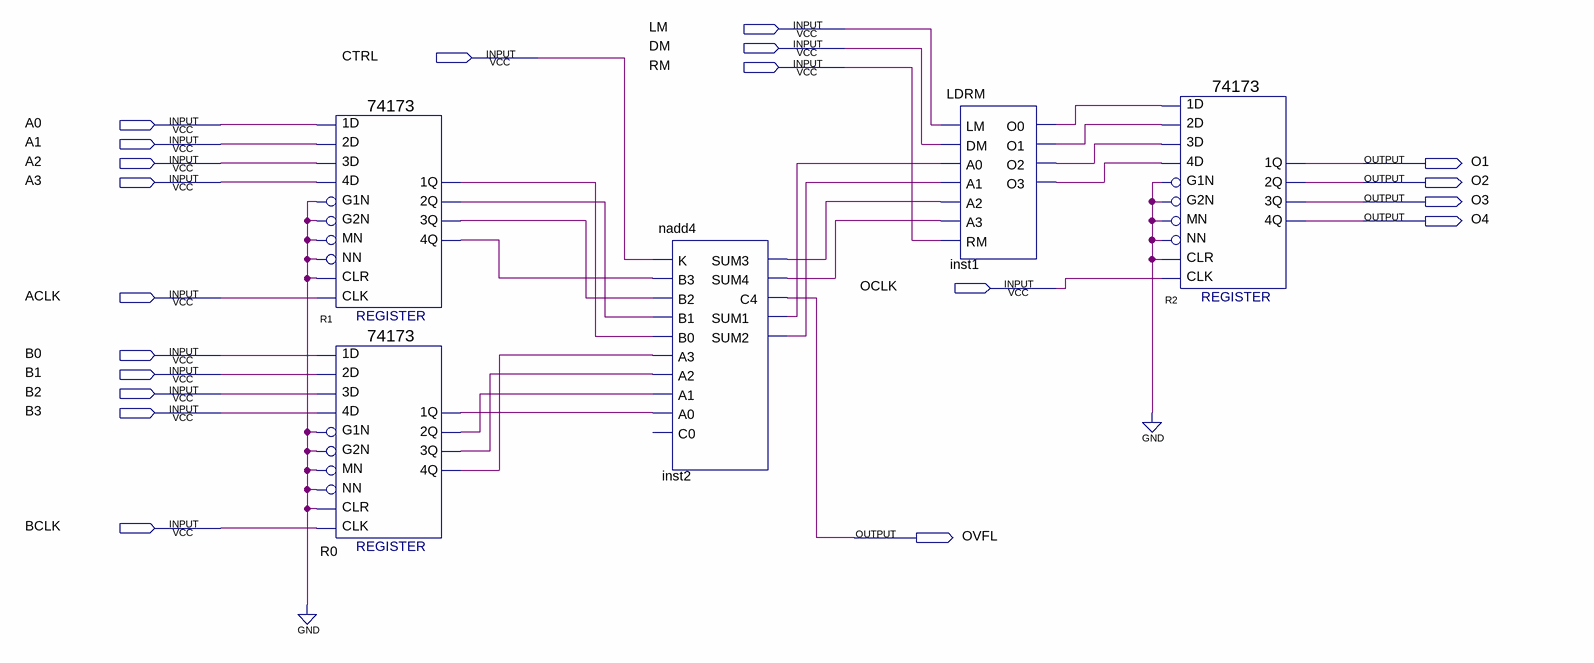
[diagram p0: schematic sheet]
// Quartus schematic Block14.bdf as structural Verilog: 5 symbols, 20 pins
module Block14 (
  input  LM,
  input  DM,
  input  CTRL,
  input  RM,
  input  A0,
  input  A1,
  input  A2,
  input  A3,
  input  OCLK,
  input  ACLK,
  input  B0,
  input  B1,
  input  B2,
  input  B3,
  input  BCLK,
  output O1,
  output O2,
  output O3,
  output O4,
  output OVFL
);

  wire inst1_o0, inst1_o1, inst1_o2, inst1_o3, inst2_sum1, inst2_sum2, inst2_sum3, inst2_sum4, R0_1q, R0_2q,
       R0_3q, R0_4q, R1_1q, R1_2q, R1_3q, R1_4q;

  \74173  R1 (
    .\3D (A2), .MN(1'b0), .\1D (A0), .\2D (A1), .\4D (A3), .G1N(1'b0), .G2N(1'b0), .NN(1'b0), .CLR(1'b0),
    .CLK(ACLK), .\3Q (R1_3q), .\2Q (R1_2q), .\1Q (R1_1q), .\4Q (R1_4q));
  \74173  R0 (
    .\3D (B2), .MN(1'b0), .\1D (B0), .\2D (B1), .\4D (B3), .G1N(1'b0), .G2N(1'b0), .NN(1'b0), .CLR(1'b0),
    .CLK(BCLK), .\3Q (R0_3q), .\2Q (R0_2q), .\1Q (R0_1q), .\4Q (R0_4q));
  nadd4 inst2 (
    .K(CTRL), .B3(R1_4q), .B2(R1_3q), .B1(R1_2q), .B0(R1_1q), .A3(R0_4q), .A2(R0_3q), .A1(R0_2q), .A0(R0_1q),
    .SUM3(inst2_sum3), .SUM4(inst2_sum4), .C4(OVFL), .SUM1(inst2_sum1), .SUM2(inst2_sum2));  // open: C0
  LDRM inst1 (
    .LM(LM), .DM(DM), .A0(inst2_sum1), .A1(inst2_sum2), .A2(inst2_sum3), .A3(inst2_sum4), .RM(RM),
    .O0(inst1_o0), .O1(inst1_o1), .O2(inst1_o2), .O3(inst1_o3));
  \74173  R2 (
    .\3D (inst1_o2), .MN(1'b0), .\1D (inst1_o0), .\2D (inst1_o1), .\4D (inst1_o3), .G1N(1'b0), .G2N(1'b0),
    .NN(1'b0), .CLR(1'b0), .CLK(OCLK), .\3Q (O3), .\2Q (O2), .\1Q (O1), .\4Q (O4));
endmodule
